# Altium schematic sheet Acoustics Board.SchDoc
size A
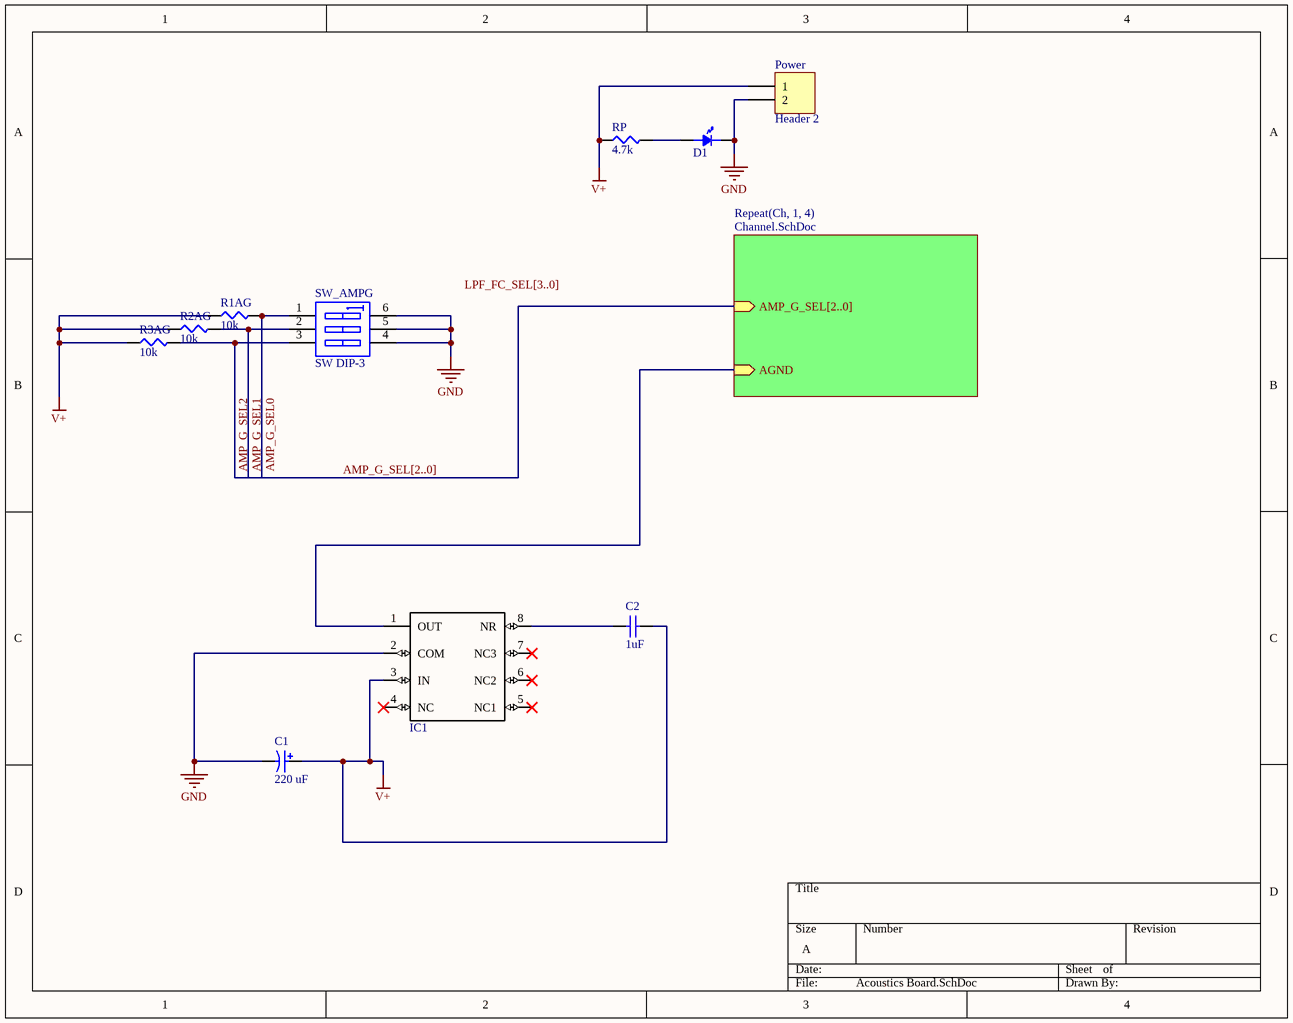
[diagram p0: Acoustics Board.SchDoc]

## Parts
C1  220 uF  [PNSC-FK-V-H13_V]
C2  value 1uF  [C0805]  (hidden comment: Cap)
D1  LED  [LED0805]  (value not drawn)
IC1  TLE2426  [SO8_M]  (value not drawn)
Power  Header 2  [HDR1X2]
R1AG  10k  [SMD-0805-RES]
R2AG  10k  [SMD-0805-RES]
R3AG  10k  [SMD-0805-RES]
RP  4.7k  [SMD-0805-RES]
SW_AMPG  SW DIP-3  [DIP-6]

## Sub-sheets
Repeat(Ch, 1, 4) = Channel.SchDoc: AMP_G_SEL[2..0] (in), AGND (in)

## Nets
GND: C1.2 D1.1 IC1.2(COM) Power.2 SW_AMPG.4(B3) SW_AMPG.5(B2) SW_AMPG.6(B1)
V+: C1.1 C2.1 IC1.3(IN) Power.1 R1AG.1 R2AG.1 R3AG.1 RP.1
AMP_G_SEL0: R1AG.2 SW_AMPG.1(A1)
AMP_G_SEL1: R2AG.2 SW_AMPG.2(A2)
AMP_G_SEL2: R3AG.2 SW_AMPG.3(A3)
NetC2_2: C2.2 IC1.8(NR)
NetD1_2: D1.2 RP.2
NetIC1_1: IC1.1(OUT) ; sheet Repeat(Ch, 1, 4)/AGND

Not connected (* = marked no-connect by the designer): IC1 4(NC)* 5(NC1)* 6(NC2)* 7(NC3)*

## Buses and harness runs
bus AMP_G_SEL[2..0] = sheet Repeat(Ch, 1, 4)/AMP_G_SEL[2..0]
bus LPF_FC_SEL[3..0]

## Notes on the sheet
- Labels drawn without touching a wire or pin: LPF_FC_SEL[3..0]

## Library data of the parts
C1 = CMP-2000-06222-1: Aluminum Electrolytic Capacitor, 220 uF, +/- 20%, 63 V, 2-Pin SMD (Size Code H13), -55 to 105 degC, RoHS, Tape and Reel; Manufacturer: Panasonic; Impedance: 0.16ohm; Life Time @ Temperature: 2000hours@105°C; Product Range: PANASONIC-?????FK; Voltage Rating: 63V; External Length / Height: 13.5mm; Ripple Current Temperature: 105°C; Ripple Current Frequency: 100kHz; Ripple Current AC: 800mA; Power Factor: 0.08; Power Factor Frequency: 120Hz; AE Capacitor Case: RadialCan-SMD; Capacitance: 220µF; Operating Lifetime: 2000h; SVHC: NoSVHC(16-Dec-2013); Diameter: 12.5mm; Package Description: 2-Pin Electrolytic Aluminum Capacitor, Body 13.5 x 13.5 mm; Height: 13.5mm; Package URL: http://industrial.panasonic.com/cdbs/www-data/pdf/RDE0000/DME0000COL48.pdf; Lifetime @ Temperature: 2000hours@105°C; Series: FK; Mounting Technology: SurfaceMount; Datasheet Version: 03/2016; Package / Case: H13; Voltage Rating V DC: 63V; Capacitance Tolerance ±: ±20%; Tolerance +: 20%; Capacitance Tolerance: ±20%; Package Reference: FK-V-H13; Datasheet URL: https://industrial.panasonic.com/cdbs/www-data/pdf/RDE0000/ABA0000C1181.pdf; Operating Temperature Range: -55°Cto+105°C; Manufacturer URL: http://www.panasonic.com/; Operating Temperature Min: -55°C; Capacitor Terminals: SMD; Packaging: CutTape; Operating Temperature Max: 105°C; Tolerance -: 20%; Operating life Time: 2000h; Capacitor Case Style: SMD
C2 = Cap: Unpolarized Capacitor
IC1 = TLE2426: in signal-conditioning applications utilizing a single power source a reference voltage equal to one-half the supply ...; MF: Texas Instruments; Price: None; SnapEDA_Link: https://www.snapeda.com/parts/TLE2426/Texas%20Instruments/view-part/?ref=snap; MP: TLE2426; Package: SOIC-8 Texas Instruments; Availability: Unavailable; Value: *
Power = Header 2: Header, 2-Pin; LatestRevisionDate: 17-Jul-2002; LatestRevisionNote: Re-released for DXP Platform.; Publisher: Altium Limited
R1AG R2AG R3AG RP = ERJ-6ENF1002V: RES SMD 10K OHM 1% 1/8W 0805; Manufacturer: Panasonic Electronic Components; Factory Stock: 0; Unit Price (USD): 0.00729; @ qty: 1500; Minimum Quantity: 1; Power (Watts): 0.125W, 1/8W; Temperature Coefficient: ±100ppm/°C; Part Number: ERJ-6ENF1002V; Datasheets: http://industrial.panasonic.com/www-cgi/jvcr13pz.cgi?E+PZ+3+AOA0002+ERJ6ENF1002V+7+WW; Image: //media.digikey.com/Renders/Panasonic%20Renders/ERJ-0805%20Pkg.jpg; Digi-Key Part Number: P10.0KCCT-ND; Quantity Available: 3985614; Packaging: Cut Tape (CT); Series: ERJ; Part Status: Active; Tolerance: ±1%; Composition: Thick Film; Features: Automotive AEC-Q200; Operating Temperature: -55°C ~ 155°C; Package / Case: 0805 (2012 Metric); Supplier Device Package: 0805; Size / Dimension: 0.079" L x 0.049" W (2.00mm x 1.25mm); Height - Seated (Max): 0.028" (0.70mm); Number of Terminations: 2; Failure Rate: -
  R1AG R2AG R3AG: Value: 10k
  RP: Value: 4.7k
SW_AMPG = SW DIP-3: DIP Switch, 3 Position, SPST; Published: 24-Mar-1999; LatestRevisionDate: 17-Jul-2002; LatestRevisionNote: Re-released for DXP Platform.; PackageReference: DIP-6; Publisher: Altium Limited; Code_JEDEC: MO-001-AM